# Altium schematic sheet node.SchDoc
size A
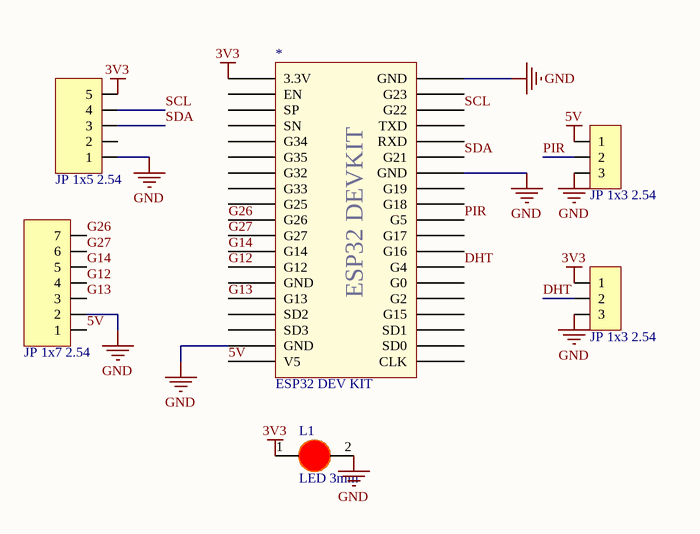
[diagram p0: node.SchDoc]

## Parts
*  ESP32 DEV KIT  [ESP32 DEVKIT]
JP1  JP 1x3 2.54  [JP 1x3 DT]
JP2  JP 1x5 2.54  [JP 1x5 CT]
JP3  JP 1x3 2.54  [JP 1x3 DT]
JP4  JP 1x7 2.54  [JP 1x7 CT]
L1  LED 3mm  [LED-3MM-RED]

## Nets
3V3: *.1(3.3V) JP2.5 JP3.1 L1.1(A)
5V: *.19(V5) JP1.1 JP4.1
GND: *.18(GND) *.32(GND) *.38(GND) JP1.3 JP2.1 JP3.3 JP4.2 L1.2(K)
DHT: *.26(G4) JP3.2
G12: *.13(G12) JP4.4
G13: *.15(G13) JP4.3
G14: *.12(G14) JP4.5
G26: *.10(G26) JP4.7
G27: *.11(G27) JP4.6
PIR: *.29(G5) JP1.2
SCL: *.36(G22) JP2.4
SDA: *.33(G21) JP2.3

Not connected (* = marked no-connect by the designer): * 2(EN) 3(SP) 4(SN) 5(G34) 6(G35) 7(G32) 8(G33) 9(G25) 14(GND) 16(SD2) 17(SD3) 20(CLK) 21(SD0) 22(SD1) 23(G15) 24(G2) 25(G0) 27(G16) 28(G17) 30(G18) 31(G19) 34(RXD) 35(TXD) 37(G23); JP2 2

## Notes on the sheet
- (in symbol ESP32 DEV KIT) ESP32 DEVKIT

## Library data of the parts
JP1 JP3 = JP 1x3 2.54 Duc Thang: Cắm; Ten_Linh_Kien: Jump Đơn Đực 2.54MM 1x40P Thẳng 11MM; Don_Vi: Con; Ma_Hang: MH000903; Ghi_Chu: *; Kieu_Chan: *; Chung_Loai: Cắm
JP2 = JP 1x5 2.54 Cai Thang: Cắm; Ten_Linh_Kien: Jump Đơn Cái 2.54MM 1x20P Thẳng; Don_Vi: Con; Ma_Hang: MH004006; Ghi_Chu: *; Kieu_Chan: *; Chung_Loai: Cắm
JP4 = JP 1x7 2.54 Cai Thang: Cắm; Ten_Linh_Kien: Jump Đơn Cái 2.54MM 1x20P Thẳng; Don_Vi: Con; Ma_Hang: MH004006; Ghi_Chu: *; Kieu_Chan: *; Chung_Loai: Cắm
L1 = LED 3mm Do: Cắm; Don_Vi: Con; Ma_Hang: MH003892; Ten_Linh_Kien: Led 3MM Phủ Đỏ (10c); Ghi_Chu: *; Kieu_Chan: *; Chung_Loai: Cắm